# Altium project TPA3221.PrjPcb
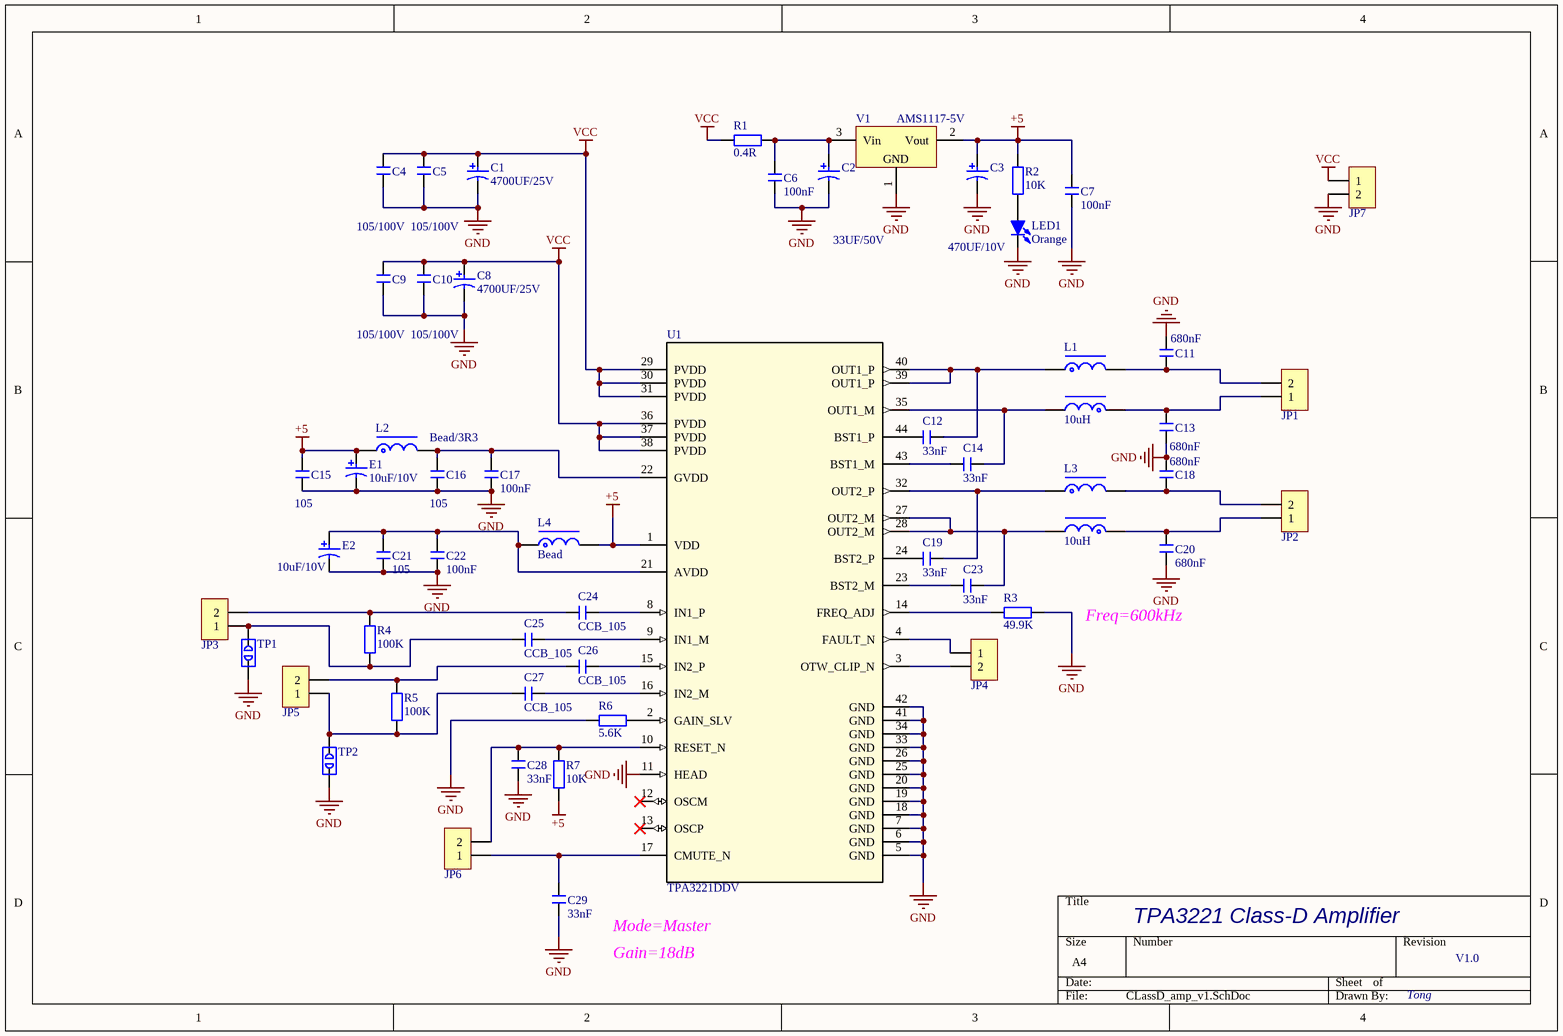
[diagram p0: CLassD_amp_v1.SchDoc]
1 sheet, 54 parts. Net scope: global (net labels, ports and power ports of the same name join across sheets).
Board file: ClassD_amp_v1.0.PcbDoc

## Sheet CLassD_amp_v1.SchDoc
size A4

### Parts
C1  4700UF/25V  [CAP 7.5*16*31.5]
C2  33UF/50V  [CAP 2.5*6.3*11.2]
C3  470UF/10V  [CAP 2.5*6.3*11.2]
C4  105/100V  [C 1206_little]
C5  105/100V  [C 1206_little]
C6  100nF  [C 0603]
C7  100nF  [C 0603]
C8  4700UF/25V  [CAP 7.5*16*31.5]
C9  105/100V  [C 1206_little]
C10  105/100V  [C 1206_little]
C11  680nF  [Xcap2]
C12  33nF  [C 0603]
C13  680nF  [Xcap2]
C14  33nF  [C 0603]
C15  105  [C 0603]
C16  105  [C 0603]
C17  100nF  [C 0603]
C18  680nF  [Xcap2]
C19  33nF  [C 0603]
C20  680nF  [Xcap2]
C21  105  [C 0603]
C22  100nF  [C 0603]
C23  33nF  [C 0603]
C24  CCB_105  [CCB_Cap_7.5mm]
C25  CCB_105  [CCB_Cap_7.5mm]
C26  CCB_105  [CCB_Cap_7.5mm]
C27  CCB_105  [CCB_Cap_7.5mm]
C28  33nF  [C 0603]
C29  33nF  [C 0603]
E1  10uF/10V  [CD B(3528)]
E2  10uF/10V  [CD B(3528)]
JP1  HDR-1X2  [KF128-3.81-2P]  (value not drawn)
JP2  HDR-1X2  [KF128-3.81-2P]  (value not drawn)
JP3  HDR-1X2  [HDR-1X2]  (value not drawn)
JP4  HDR-1X2  [HDR-1X2]  (value not drawn)
JP5  HDR-1X2  [HDR-1X2]  (value not drawn)
JP6  HDR-1X2  [HDR-1X2]  (value not drawn)
JP7  HDR-1X2  [KF128-3.81-2P]  (value not drawn)
L1  10uH  [L]
L2  Bead/3R3  [L 0805]
L3  10uH  [L]
L4  Bead  [L 0805]
LED1  Orange  [LED 0603R]
R1  0.4R  [Res-SMD-1206]
R2  10K  [Res-SMD-0603]
R3  49.9K  [Res-SMD-0603]
R4  100K  [Res-SMD-0603]
R5  100K  [Res-SMD-0603]
R6  5.6K  [Res-SMD-0603]
R7  10K  [Res-SMD-0603]
TP1  (no value)  [DEBUG PAD2]
TP2  (no value)  [DEBUG PAD2]
U1  TPA3221DDV  [DDV0044D_N]
V1  AMS1117-5V  [SOT223_L]

### Nets
+5: C3.A C7.2 C15.2 E1.A L2.1 L4.2 R2.2 R7.1 U1.1(VDD) V1.2(Vout)
GND: C1.K C2.K C3.K C4.2 C5.2 C6.1 C7.1 C8.K C9.2 C10.2 C11.2 C13.2 C15.1 C16.1 C17.1 C18.2 C20.2 C21.1 C22.1 C28.2 C29.2 E1.K E2.K JP7.2 LED1.2(K) R3.2 R6.1 TP1.1 TP2.1 U1.5(GND) U1.6(GND) U1.7(GND) U1.11(HEAD) U1.18(GND) U1.19(GND) U1.20(GND) U1.25(GND) U1.26(GND) U1.33(GND) U1.34(GND) U1.41(GND) U1.42(GND) V1.1(GND)
VCC: C1.A C4.1 C5.1 C8.A C9.1 C10.1 JP7.1 R1.1 U1.29(PVDD) U1.30(PVDD) U1.31(PVDD) U1.36(PVDD) U1.37(PVDD) U1.38(PVDD)
NetC2_A: C2.A C6.2 R1.2 V1.3(Vin)
NetC11_1: C11.1 JP1.2 L1.2
NetC12_1: C12.1 U1.44(BST1_P)
NetC12_2: C12.2 L1.1 U1.39(OUT1_P) U1.40(OUT1_P)
NetC13_1: C13.1 JP1.1 L1.4
NetC14_1: C14.1 U1.43(BST1_M)
NetC14_2: C14.2 L1.3 U1.35(OUT1_M)
NetC16_2: C16.2 C17.2 L2.2 U1.22(GVDD)
NetC18_1: C18.1 JP2.2 L3.2
NetC19_1: C19.1 U1.24(BST2_P)
NetC19_2: C19.2 L3.1 U1.32(OUT2_P)
NetC20_1: C20.1 JP2.1 L3.4
NetC21_2: C21.2 C22.2 E2.A L4.1 U1.21(AVDD)
NetC23_1: C23.1 U1.23(BST2_M)
NetC23_2: C23.2 L3.3 U1.27(OUT2_M) U1.28(OUT2_M)
NetC24_1: C24.1 JP3.2 R4.2
NetC24_2: C24.2 U1.8(IN1_P)
NetC25_1: C25.1 JP3.1 R4.1 TP1.2
NetC25_2: C25.2 U1.9(IN1_M)
NetC26_1: C26.1 JP5.2 R5.2
NetC26_2: C26.2 U1.15(IN2_P)
NetC27_1: C27.1 JP5.1 R5.1 TP2.2
NetC27_2: C27.2 U1.16(IN2_M)
NetC28_1: C28.1 JP6.2 R7.2 U1.10(RESET_N)
NetC29_1: C29.1 JP6.1 U1.17(CMUTE_N)
NetJP4_1: JP4.1 U1.4(FAULT_N)
NetJP4_2: JP4.2 U1.3(OTW_CLIP_N)
NetLED1_1: LED1.1(A) R2.1
NetR3_1: R3.1 U1.14(FREQ_ADJ)
NetR6_2: R6.2 U1.2(GAIN_SLV)

Not connected (* = marked no-connect by the designer): U1 12(OSCM)* 13(OSCP)*

### Notes on the sheet
- Freq=600kHz
- TPA3221 Class-D Amplifier
- Mode=Master
- Gain=18dB
- V1.0
- Tong

### Library data of the parts
C1-C3 C8 = Cap-AE-RAD: 铝电解电容-直插
C4-C7 C9-C29 = Cap-CER-SMD: 瓷片电容-贴片
E1 E2 = Cap-TAN-SMD: 钽电解电容-贴片
JP1-JP7 = Header 2: 2P接插件; 版权归属: 源创客; BOM名称: 2P接插件; 学习资源: www.ooocke.com
L1 L3 = L
L2 L4 = Ind-Beads-SMD: 贴片电感-小功率
LED1 = LED-SMD: LED; BOM名称: 贴片LED; 版权归属: 源创客; 学习资源: www.ooocke.com
R1-R7 = Res-Fixed-SMD: 固定电阻器-贴片
TP1 TP2 = DEBUG: 调试断点焊盘; 版权归属: 源创客; BOM名称: 调试断点焊盘; 学习资源: www.ooocke.com
U1 = TPA3221DDV: No Description Available; Manufacturer: Texas Instruments; PartNumber: TPA3221DDVR; RefDes: RefDes; Type: DEV; Value: Value; Copyright: Copyright (C) 2018 Accelerated Designs. All rights reserved
V1 = AMS1117: 三端稳压芯片; BOM名称: 稳压芯片; 版权归属: 源创客; 学习资源: www.ooocke.com